# Altium project ApexVent1.PrjPcb
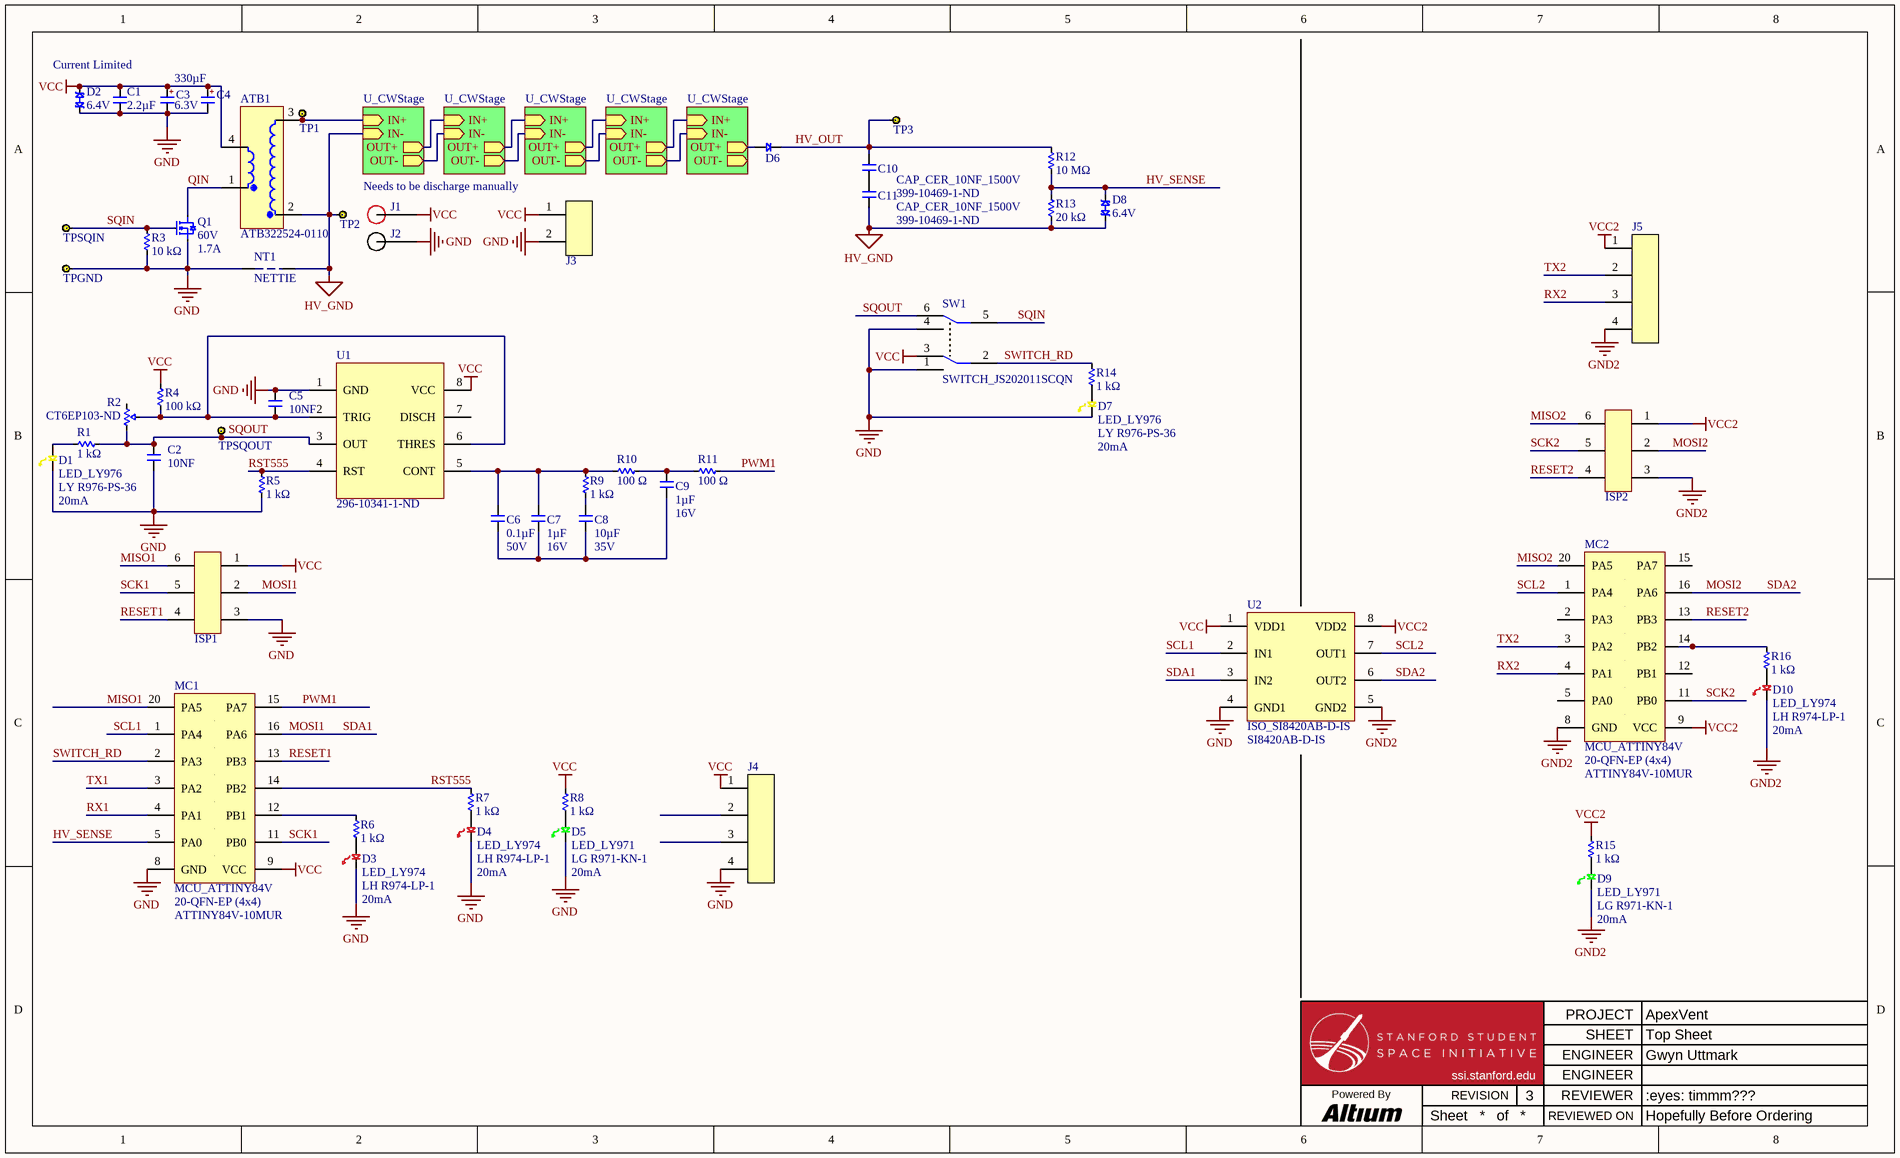
[diagram p0: TopSheet.SchDoc]
prjTitle: ApexVent; prjRevision: 3; prjReviewer: :eyes: timmm???; prjReviewDate: Hopefully Before Ordering; prjEngineer1: Gwyn Uttmark
2 sheets, 88 parts. Net scope: strictly hierarchical (ports join the sheet entries above them; power ports are local).
Board file: TopSheet.PcbDoc
Sheets:
  TopSheet.SchDoc
    U_CWStage = CWStage.SchDoc
    U_CWStage = CWStage.SchDoc
    U_CWStage = CWStage.SchDoc
    U_CWStage = CWStage.SchDoc
    U_CWStage = CWStage.SchDoc

## Sheet TopSheet.SchDoc: Top Sheet
size Legal; Project: World Domination Satellite

### Parts
ATB1  ATB322524-0110  [ATB3225]
C1  Capacitance (shorthand): 2.2µF  [C0603]  (hidden comment: __template_cap)
C2  10NF  [C1206]
C3  Capacitance: 330µF  Voltage - Rated: 6.3V  [C1210P]  (hidden comment: CAP_TANT_330UF_6.3V)
C4  CAP_TANT_330UF_6.3V  [C1210P]  (value not drawn)
C5  10NF  [C1206]
C6  Capacitance (shorthand): 0.1µF  Rated Voltage: 50V  [C0603]  (hidden comment: __template_cap)
C7  Capacitance (shorthand): 1µF  Rated Voltage: 16V  [C0603]  (hidden comment: __template_cap)
C8  Capacitance (shorthand): 10µF  Rated Voltage: 35V  [C0603]  (hidden comment: __template_cap)
C9  Capacitance (shorthand): 1µF  Rated Voltage: 16V  [C0603]  (hidden comment: __template_cap)
C10  CAP_CER_10NF_1500V  Supplier Part Number 1: 399-10469-1-ND  [C1206]
C11  CAP_CER_10NF_1500V  Supplier Part Number 1: 399-10469-1-ND  [C1206]
D1  LED_LY976  Manufacturer Part Number: LY R976-PS-36  Current - Test: 20mA  [0805_Diode]
D2  Voltage - Breakdown: 6.4V  [SMC]  (hidden comment: TVS_BI_SMDJ5.0CA)
D3  LED_LY974  Manufacturer Part Number: LH R974-LP-1  Current - Test: 20mA  [0805_Diode]
D4  LED_LY974  Manufacturer Part Number: LH R974-LP-1  Current - Test: 20mA  [0805_Diode]
D5  LED_LY971  Manufacturer Part Number: LG R971-KN-1  Current - Test: 20mA  [0805_Diode]
D6  DIODE_ S1PM-M3/84A  [DO-220AA]  (value not drawn)
D7  LED_LY976  Manufacturer Part Number: LY R976-PS-36  Current - Test: 20mA  [0805_Diode]
D8  Voltage - Breakdown: 6.4V  [SMC]  (hidden comment: TVS_BI_SMDJ5.0CA)
D9  LED_LY971  Manufacturer Part Number: LG R971-KN-1  Current - Test: 20mA  [0805_Diode]
D10  LED_LY974  Manufacturer Part Number: LH R974-LP-1  Current - Test: 20mA  [0805_Diode]
ISP1  CONN_2x3_15-91-2060  [MOLEX_15-91-2060]  (value not drawn)
ISP2  CONN_2x3_15-91-2060  [MOLEX_15-91-2060]  (value not drawn)
J1  J2  [CONN_BANANA_CALTEST_RED]  (value not drawn)
J2  CONN_BANNANAJACK_RA_BLACK_CT3151SP  [CONN_BANANA_CALTEST_BLACk]  (value not drawn)
J3  CONN HEADER 2POS VERT T/H  [CONN_1x2_100MIL]  (value not drawn)
J4  CONN_1x4  [CONN_1x4_100MIL]  (value not drawn)
J5  CONN_1x4  [CONN_1x4_100MIL]  (value not drawn)
MC1  MCU_ATTINY84V  Supplier Device Package: 20-QFN-EP (4x4)  Manufacturer Part Number: ATTINY84V-10MUR  [20QFN4]
MC2  MCU_ATTINY84V  Supplier Device Package: 20-QFN-EP (4x4)  Manufacturer Part Number: ATTINY84V-10MUR  [20QFN4]
NT1  NETTIE  [NETTIE_10MIL]  (net tie, no BOM)
Q1  Drain to Source Voltage (Vdss): 60V  Current - Continuous Drain (Id) @ 25° C: 1.7A  [3SOT23]  (hidden comment: MOSFET N-CH 60V 1.7A SSOT3)
R1  Resistance: 1 kΩ  [R0805]  (hidden comment: __template_resistor)
R2  Supplier Part Number 1: CT6EP103-ND  [CT6EP]  (hidden comment: POT_10K_CT6EP103)
R3  Resistance: 10 kΩ  [R0603]  (hidden comment: __template_resistor)
R4  Resistance: 100 kΩ  [R0805]  (hidden comment: __template_resistor)
R5  Resistance: 1 kΩ  [R0805]  (hidden comment: __template_resistor)
R6  Resistance: 1 kΩ  [R0805]  (hidden comment: __template_resistor)
R7  Resistance: 1 kΩ  [R0805]  (hidden comment: __template_resistor)
R8  Resistance: 1 kΩ  [R0805]  (hidden comment: __template_resistor)
R9  Resistance: 1 kΩ  [R0805]  (hidden comment: __template_resistor)
R10  Resistance: 100 Ω  [R0805]  (hidden comment: __template_resistor)
R11  Resistance: 100 Ω  [R0805]  (hidden comment: __template_resistor)
R12  Resistance: 10 MΩ  [R0805]  (hidden comment: __template_resistor)
R13  Resistance: 20 kΩ  [R0805]  (hidden comment: __template_resistor)
R14  Resistance: 1 kΩ  [R0805]  (hidden comment: __template_resistor)
R15  Resistance: 1 kΩ  [R0805]  (hidden comment: __template_resistor)
R16  Resistance: 1 kΩ  [R0805]  (hidden comment: __template_resistor)
SW1  SWITCH_JS202011SCQN  [SWITCH_DUAL_POS]
TP1  TEST_POINT_BLACK_KEYSTONE_5001  [TEST_POINT_KEYSTONE_5001]  (value not drawn)
TP2  TEST_POINT_BLACK_KEYSTONE_5001  [TEST_POINT_KEYSTONE_5001]  (value not drawn)
TP3  TEST_POINT_BLACK_KEYSTONE_5001  [TEST_POINT_KEYSTONE_5001]  (value not drawn)
TPGND  TEST_POINT_BLACK_KEYSTONE_5001  [TEST_POINT_KEYSTONE_5001]  (value not drawn)
TPSQIN  TEST_POINT_BLACK_KEYSTONE_5001  [TEST_POINT_KEYSTONE_5001]  (value not drawn)
TPSQOUT  TEST_POINT_BLACK_KEYSTONE_5001  [TEST_POINT_KEYSTONE_5001]  (value not drawn)
U1  Supplier Part Number 1: 296-10341-1-ND  [8SOIC150]  (hidden comment: TIM_TLC555)
U2  ISO_SI8420AB-D-IS  Manufacturer Part Number: SI8420AB-D-IS  [8SOIC150]

### Sub-sheets
U_CWStage = CWStage.SchDoc: IN- (in), IN+ (in), OUT+ (out), OUT- (out)
U_CWStage = CWStage.SchDoc: IN- (in), IN+ (in), OUT+ (out), OUT- (out)
U_CWStage = CWStage.SchDoc: IN- (in), IN+ (in), OUT+ (out), OUT- (out)
U_CWStage = CWStage.SchDoc: IN- (in), IN+ (in), OUT+ (out), OUT- (out)
U_CWStage = CWStage.SchDoc: IN- (in), IN+ (in), OUT+ (out), OUT- (out)

### Nets
GND: C1.2 C2.2 C3.2 C4.2 C5.1 D1.1 D2.1 D3.1 D4.1 D5.1 D7.1 ISP1.3 J2.SIG J3.2 J4.4 MC1.8(GND) NT1.1 Q1.2 R3.1 R5.1 SW1.1 SW1.4 TPGND.1 U1.1(GND) U2.4(GND1)
GND2: D9.1 D10.1 ISP2.3 J5.4 MC2.8(GND) U2.5(GND2)
HV_GND: ATB1.2 C11.1 D8.1 NT1.2 R13.2 TP2.1 ; sheet U_CWStage/IN-
VCC: ATB1.4 C1.1 C3.1 C4.1 D2.2 ISP1.1 J1.SIG J3.1 J4.1 MC1.9(VCC) R4.2 R8.2 SW1.3 U1.8(VCC) U2.1(VDD1)
VCC2: ISP2.1 J5.1 MC2.9(VCC) R15.2 U2.8(VDD2)
HV_OUT: C10.2 D6.1 R12.1 TP3.1
HV_SENSE: D8.2 MC1.5(PA0) R12.2 R13.1
MISO1: ISP1.6 MC1.20(PA5)
MISO2: ISP2.6 MC2.20(PA5)
MOSI1: ISP1.2 MC1.16(PA6) U2.3(IN2)  [also labelled SDA1]
MOSI2: ISP2.2 MC2.16(PA6) U2.6(OUT2)  [also labelled SDA2]
PWM1: MC1.15(PA7) R11.2
QIN: ATB1.1 Q1.3
RESET1: ISP1.4 MC1.13(PB3)
RESET2: ISP2.4 MC2.13(PB3)
RST555: MC1.14(PB2) R5.2 R7.2 U1.4(RST)
RX1: MC1.4(PA1)
RX2: J5.3 MC2.4(PA1)
SCK1: ISP1.5 MC1.11(PB0)
SCK2: ISP2.5 MC2.11(PB0)
SCL1: MC1.1(PA4) U2.2(IN1)
SCL2: MC2.1(PA4) U2.7(OUT1)
SQIN: Q1.1 R3.2 SW1.5 TPSQIN.1
SQOUT: C2.1 R1.1 R2.1 SW1.6 TPSQOUT.1 U1.3(OUT)
SWITCH_RD: MC1.2(PA3) R14.2 SW1.2
TX1: MC1.3(PA2)
TX2: J5.2 MC2.3(PA2)
NetATB1_3: ATB1.3 TP1.1 ; sheet U_CWStage/IN+
NetC5_2: C5.2 R2.2 R4.1 U1.2(TRIG) U1.6(THRES)
NetC6_1: C6.1 C7.1 R9.2 R10.1 U1.5(CONT)
NetC6_2: C6.2 C7.2 C8.2 C9.2
NetC8_1: C8.1 R9.1
NetC9_1: C9.1 R10.2 R11.1
NetC10_1: C10.1 C11.2
NetC12A_2: sheet U_CWStage/OUT+, sheet U_CWStage/IN+
NetC12B_2: sheet U_CWStage/OUT+, sheet U_CWStage/IN+
NetC12C_2: sheet U_CWStage/OUT+, sheet U_CWStage/IN+
NetC12D_2: sheet U_CWStage/OUT+, sheet U_CWStage/IN+
NetC12E_2: D6.2 ; sheet U_CWStage/OUT+
NetC13A_2: sheet U_CWStage/OUT-, sheet U_CWStage/IN-
NetC13B_2: sheet U_CWStage/OUT-, sheet U_CWStage/IN-
NetC13C_2: sheet U_CWStage/OUT-, sheet U_CWStage/IN-
NetC13D_2: sheet U_CWStage/OUT-, sheet U_CWStage/IN-
NetD1_2: D1.2 R1.2
NetD3_2: D3.2 R6.1
NetD4_2: D4.2 R7.1
NetD5_2: D5.2 R8.1
NetD7_2: D7.2 R14.1
NetD9_2: D9.2 R15.1
NetD10_2: D10.2 R16.1
NetMC1_12: MC1.12(PB1) R6.2
NetMC2_14: MC2.14(PB2) R16.2

Not connected (* = marked no-connect by the designer): J4 2 3; MC1 6(DNC) 7(DNC) 10(DNC) 17(DNC) 18(DNC) 19(DNC); MC2 2(PA3) 5(PA0) 6(DNC) 7(DNC) 10(DNC) 12(PB1) 15(PA7) 17(DNC) 18(DNC) 19(DNC); R2 3; U1 7(DISCH)

### Notes on the sheet
- Current Limited
- Needs to be discharge manually
- PROJECT
- SHEET
- Powered By
- Sheet
- of
- REVISION
- ssi.stanford.edu
- ENGINEER
- REVIEWER
- REVIEWED ON
- (in symbol CAP_TANT_330UF_6.3V) +

### Library data of the parts
ATB1 = CMP-053-0002-3: DC Resistance (DCR): 60R; Inductance: 7uH; Isolation Voltage: 500V; Lead/Base Style: Solder; Max DC Current: 700mA; Turns Ratio: 1:10; Height: 2.4mm; Width: 2.5mm; Packaging: Tape and Reel; Package Quantity: 1; Mount: Surface Mount; Lead Free: Lead Free; Depth: 2.4mm; Length: 3.2mm; Termination: SMD/SMT; Max Operating Temperature: 85°C; Height - Seated (Max): 2.4mm; Min Operating Temperature: -40°C
C1 = 490-10731-1-ND: CAP CER 2.2UF 16V X5R 0603 10%; Rated Voltage: 25V; Supplier Part Number 1: 490-10731-1-ND
C2 C5 = CAP_CER_10NF_1500V: Supplier 1: Digi-Key; Supplier Part Number 1: 399-10469-1-ND
C3 = CAP_TANT_330UF_6.3V: 330UF 1210 SMD TANTALUM CAPACITOR; Manufacturer: AVX Corporation; Manufacturer Part Number: F950J337KBAAQ2; Manufacturer Size Code: B; Tolerance: ±10%; ESR (Equivalent Series Resistance): 600 mOhm; Type: Conformal Coated; Supplier 1: Digi-Key; RoHS: RoHS Compliant; Category: Capacitors; Stock 1: 12610; Pricing 1: 1=2.24, 10=1.857, 100=1.5567, 250=1.28356, 500=1.14702, 1000=1.03778 (USD); Packaging: Cut Tape (CT); Operating Temperature: -55°C ~ 125°C; Mounting Type: Surface Mount; Package / Case: 1210 (3528 Metric); Size / Dimension: 0.138" L x 0.110" W (3.50mm x 2.80mm); Height - Seated (Max): 0.079" (2.00mm); Lead Spacing: -; Features: General Purpose; Lifetime @ Temp.: -; ComponentLink1URL: http://datasheets.avx.com/f95.pdf; ComponentLink1Description: http://datasheets.avx.com/f95.pdf; Supplier Part Number 1: 478-8407-1-ND
C4 = CAP_TANT_330UF_6.3V: 330UF 1210 SMD TANTALUM CAPACITOR; Manufacturer: AVX Corporation; Manufacturer Part Number: F950J337KBAAQ2; Manufacturer Size Code: B; Tolerance: ±10%; ESR (Equivalent Series Resistance): 600 mOhm; Type: Conformal Coated; Capacitance: 330µF; Voltage - Rated: 6.3V; Supplier 1: Digi-Key; RoHS: RoHS Compliant; Category: Capacitors; Stock 1: 12610; Pricing 1: 1=2.24, 10=1.857, 100=1.5567, 250=1.28356, 500=1.14702, 1000=1.03778 (USD); Packaging: Cut Tape (CT); Operating Temperature: -55°C ~ 125°C; Mounting Type: Surface Mount; Package / Case: 1210 (3528 Metric); Size / Dimension: 0.138" L x 0.110" W (3.50mm x 2.80mm); Height - Seated (Max): 0.079" (2.00mm); Lead Spacing: -; Features: General Purpose; Lifetime @ Temp.: -; ComponentLink1URL: http://datasheets.avx.com/f95.pdf; ComponentLink1Description: http://datasheets.avx.com/f95.pdf; Supplier Part Number 1: 478-8407-1-ND
C6 = 490-1519-1-ND: CAP CER 0603 0.1µF X7R 50V 10%; Manufacturer: Murata Electronics North America; Capacitance - pF (Machine readable): #NAME?; type: capacitor; Supplier Part Number 1: 490-1519-1-ND; Dielectric: X7R; Supplier 1: Digikey
C7 C9 = 490-3900-1-ND: CAP CER 0603 1µF X7R 16V 10%; Manufacturer: Murata Electronics North America; Capacitance - pF (Machine readable): #NAME?; type: capacitor; Supplier Part Number 1: 490-3900-1-ND; Dielectric: X7R; Supplier 1: Digikey
C8 = 490-13248-1-ND: CAP CER 10UF 35V X5R 0603 20%; Manufacturer: Murata Electronics North America; Capacitance - pF (Machine readable): #NAME?; type: capacitor; Supplier Part Number 1: 490-13248-1-ND; Dielectric: X5R; Supplier 1: Digikey
D1 D7 = CMP-033-0002-1: LED 0805 YELLOW 20MA; Manufacturer: OSRAM Opto Semiconductors Inc; Lens Color: White; Lens Transparency: Diffused; Lens Style/Size: Rectangle with Flat Top, 1.30mm x 1.25mm; Voltage - Forward (Vf) (Typ): 2V; Wavelength - Peak: 591nm; Millicandela Rating: 162.5mcd; Wavelength - Dominant: 588nm; Viewing Angle: 160°; Height (Max): 0.80mm; ComponentLink1Description: http://www.osram-os.com/Graphics/XPic9/00078941_0.pdf; Stock 1: 22712; ComponentLink1URL: http://www.osram-os.com/Graphics/XPic9/00078941_0.pdf; Supplier Device Package: *; Mounting Type: Surface Mount; Size / Dimension: 2.00mm L x 1.25mm W; Source: diode.SchLib; Packaging: Cut Tape (CT); Package / Case: 0805 (2012 Metric); RoHS: RoHS Compliant; Design Item ID: LED_LY976; Color: Yellow; Pricing 1: 1=0.09, 10=0.072, 100=0.0576, 250=0.0504, 500=0.04608 (USD)
D2 D8 = TVS_BI_SMDJ5.0CA: DIODE TVS 5.0V 3000W 5% BI SMD; Manufacturer: Littelfuse Inc; Polarization: Bidirectional; Voltage - Reverse Standoff (Typ): 5V; Supplier 1: Digi-Key; Manufacturer Part Number: SMDJ5.0CA; RoHS: RoHS Compliant; Category: Circuit Protection; Stock 1: 9581; Pricing 1: 1=1.14, 10=1.023, 25=0.9032, 100=0.8127, 250=0.70736, 500=0.6321, 1000=0.49665 (USD); Mounting Type: Surface Mount; Package / Case: DO-214AB, SMC; Supplier Device Package: SMC; Packaging: Cut Tape (CT); ComponentLink1URL: http://www.littelfuse.com/data/en/Data_Sheets/Littelfuse_TVS-Diodes_SMDJ.pdf; ComponentLink1Description: Datasheet; Supplier Part Number 1: SMDJ5.0CACT-ND; Power (Watts): 3000W
D3 D4 D10 = CMP-033-0001-1: LED 0805 RED 20MA; Manufacturer: OSRAM Opto Semiconductors Inc; Millicandela Rating: 41mcd; Lens Style/Size: Rectangle with Flat Top, 1.30mm x 1.25mm; Wavelength - Peak: 660nm; Lens Transparency: Diffused; Wavelength - Dominant: 645nm; Viewing Angle: 160°; Voltage - Forward (Vf) (Typ): 1.8V; Lens Color: White; Mounting Type: Surface Mount; ComponentLink1Description: http://www.osram-os.com/Graphics/XPic8/00078869_0.pdf; Pricing 1: 1=0.08, 10=0.07, 100=0.0559, 250=0.04892, 500=0.04472 (USD); Packaging: Cut Tape (CT); Size / Dimension: 2.00mm L x 1.25mm W; Design Item ID: LED_LY974; Stock 1: 66379; Package / Case: 0805 (2012 Metric); ComponentLink1URL: http://www.osram-os.com/Graphics/XPic8/00078869_0.pdf; RoHS: RoHS Compliant; Color: Red; Supplier Device Package: *; Height (Max): 0.80mm; Source: diode.SchLib
D5 D9 = CMP-033-0000-1: LED 0805 GREEN 20MA; Manufacturer: OSRAM Opto Semiconductors Inc; Lens Color: White; Wavelength - Peak: 572nm; Lens Style/Size: Rectangle with Flat Top, 1.30mm x 1.25mm; Voltage - Forward (Vf) (Typ): 2.2V; Lens Transparency: Diffused; Wavelength - Dominant: 570nm; Millicandela Rating: 26.05mcd; Viewing Angle: 160°; Source: diode.SchLib; RoHS: RoHS Compliant; ComponentLink1URL: http://www.osram-os.com/Graphics/XPic9/00078860_0.pdf; Mounting Type: Surface Mount; ComponentLink1Description: http://www.osram-os.com/Graphics/XPic9/00078860_0.pdf; Packaging: Cut Tape (CT); Supplier Device Package: *; Package / Case: 0805 (2012 Metric); Design Item ID: LED_LY971; Size / Dimension: 2.00mm L x 1.25mm W; Pricing 1: 1=0.08, 10=0.069, 100=0.0548, 250=0.04796, 500=0.04384 (USD); Stock 1: 89733; Height (Max): 0.80mm; Color: Green
ISP1 ISP2 = CMP-029-0049-1: CONN HEADER 6POS .100" VERT TIN; Manufacturer: Molex Inc; Manufacturer Part Number: 0015912060; Pitch: 0.100" (2.54mm); Number of Positions Loaded: All; Connector Type: Header, Unshrouded, Breakaway; Number of Positions: 6; Contact Finish Thickness: 150µin (3.81µm); Number of Rows: 2; ComponentLink1Description: http://www.molex.com/pdm_docs/sd/015912060_sd.pdf; Mounting Type: Surface Mount; Contact Mating Length: 0.240" (6.10mm); Stock 1: 5665; Design Item ID: CONN_2x3_15-91-2060; ComponentLink1URL: http://www.molex.com/pdm_docs/sd/015912060_sd.pdf; Pricing 1: 1=0.43, 10=0.4, 50=0.32, 100=0.3066, 250=0.27992, 500=0.2666, 1000=0.21995, 2500=0.19995, 5000=0.19329 (USD); Packaging: Bulk; Features: -; Source: connector.SchLib; Contact Finish: Tin; Fastening Type: -; Contact Type: Male Pin; Row Spacing: 0.100" (2.54mm); Termination: Solder; Color: Black; RoHS: RoHS Compliant
J1 = CONN_BANNANAJACK_RA_RED_CT3151SP: Manufacturer: B&K Precision; Manufacturer Part Number: CT3151-2; Body Material: Nylon,Polyamide; Gender: Female; Insulation: Mating End Insulated; Supplier 1: Digi-Key; Stock 1: 317; Pricing 1: 1=2.05 (USD); Colour: Red; Contact Material: Brass; Contact Plating: Nickel; Min Operating Temperature: -20°C; Max Operating Temperature: 80°C; Termination: Solder; Supplier Part Number 1: BKCT3151-2-ND
J2 = CONN_BANNANAJACK_RA_BLACK_CT3151SP: Manufacturer: B&K Precision; Manufacturer Part Number: CT3151-0; Body Material: Nylon,Polyamide; Gender: Female; Insulation: Mating End Insulated; Supplier 1: Digi-Key; Stock 1: 0; Pricing 1: 1=2.05 (USD); Colour: Black; Contact Material: Brass; Contact Plating: Nickel; Min Operating Temperature: -20°C; Max Operating Temperature: 80°C; Termination: Solder; Supplier Part Number 1: BKCT3151-0-ND
J3 = CONN_1x2: Manufacturer: FCI; Manufacturer Part Number: 77311-118-02LF; Connector Type: Header, Unshrouded; Number of Positions: 2; Number of Positions Loaded: All; Pitch: 0.100" (2.54mm); RoHS: RoHS Compliant; Category: Connectors, Interconnects; Contact Type: Male Pin; Number of Rows: 1; Row Spacing: -; Contact Mating Length: 0.230" (5.84mm); Mounting Type: Through Hole; Termination: Solder; Fastening Type: -; Features: -; Contact Finish: Gold, GXT™; Contact Finish Thickness: 30µin (0.76µm); Color: Black; Packaging: Bulk; ComponentLink1URL: http://portal.fciconnect.com/res/en/pdffiles/doc_search//77311.pdf; ComponentLink1Description: http://portal.fciconnect.com/res/en/pdffiles/doc_search//77311.pdf
J4 J5 = CMP-029-0003-1: CONN HEADER 4POS T/H; Design Item ID: CONN_1x4; Source: connector.SchLib
MC1 MC2 = CMP-049-0007-2: Attiny84 Surface Mount Extended Voltage Range; Manufacturer: Microchip Technology; Oscillator Type: Internal; EEPROM Size: 512 x 8; Core Size: 8-Bit; Connectivity: USI; Core Processor: AVR; Peripherals: Brown-out Detect/Reset, POR, PWM, Temp Sensor, WDT; Program Memory Size: 8KB (4K x 16); Data Converters: A/D 8x10b; Program Memory Type: FLASH; Speed: 10MHz; Voltage - Supply (Vcc/Vdd): 1.8 V ~ 5.5 V; Design Item ID: MCU_ATTINY84V; RoHS: RoHS Compliant; RAM Size: 512 x 8; Packaging: Cut Tape (CT); Part Status: Active; Package / Case: 20-WFQFN Exposed Pad; Operating Temperature: -40°C ~ 85°C (TA); Source: ic_processor.SchLib; Stock 1: 9687; Pricing 1: 1=1.01, 25=0.92, 100=0.835 (USD)
NT1 = CMP-057-0001-1: Net tie. Use sparingly.; Source: miscellaneous.SchLib; Design Item ID: NETTIE
Q1 = NFET_FDN5630: Manufacturer: Fairchild Semiconductor; FET Type: MOSFET N-Channel, Metal Oxide; FET Feature: Logic Level Gate; Rds On (Max) @ Id, Vgs: 100 mOhm @ 1.7A, 10V; Vgs(th) (Max) @ Id: 3V @ 250µA; Gate Charge (Qg) @ Vgs: 10nC @ 10V; Input Capacitance (Ciss) @ Vds: 400pF @ 15V; Power - Max: 460mW; Supplier 1: Digi-Key; Manufacturer Part Number: FDN5630; RoHS: RoHS Compliant; Category: Discrete Semiconductor Products; Stock 1: 136076; Pricing 1: 1=0.66, 10=0.532, 100=0.3986, 250=0.34428, 500=0.29596, 1000=0.22952 (USD); Mounting Type: Surface Mount; Package / Case: TO-236-3, SC-59, SOT-23-3; Supplier Device Package: 3-SSOT; Packaging: Cut Tape (CT); ComponentLink1URL: http://www.fairchildsemi.com/ds/FD/FDN5630.pdf; ComponentLink1Description: http://www.fairchildsemi.com/ds/FD/FDN5630.pdf; Supplier Part Number 1: FDN5630CT-ND
R1 R5-R9 R14-R16 = 311-1.00KCRCT-ND: RES SMD 1K OHM 1% 1/8W 0805; Manufacturer Part Number: RC0805FR-071KL; Manufacturer: Yageo; Resistance (Sortable): 1000; Power (Watts): 0.125W, 1/8W; Temperature Coefficient: ±100ppm/°C; Supplier Part Number 1: 311-1.00KCRCT-ND; Supplier 1: Digikey; Datasheets: http://www.yageo.com/documents/recent/PYu-RC_Group_51_RoHS_L_9.pdf; Image: //media.digikey.com/Renders/Yageo%20Renders/0805-(2012-Metric).jpg; Tolerance: ±1%; Operating Temperature: -55°C ~ 155°C
R2 = POT_10K_CT6EP103: Manufacturer: Copal Electronics Inc; Resistance (Ohms): 10k; Power (Watts): 0.5W, 1/2W; Tolerance: ±10%; Temperature Coefficient: ±100ppm/°C; Number of Turns: Single; Adjustment Type: Top Adjustment; Resistive Material: Cermet; Supplier 1: Digi-Key; Manufacturer Part Number: CT6EP103; RoHS: RoHS Compliant; Category: Potentiometers, Variable Resistors; Stock 1: 23818; Pricing 1: 1=0.79, 10=0.711, 25=0.6428, 50=0.6196, 100=0.5852, 250=0.56228, 500=0.52786, 1000=0.43605, 2500=0.39015 (USD); Packaging: Bulk; Mounting Type: Through Hole; Termination Style: PC Pin; Size / Dimension: Square - 0.276" x 0.276" Face x 0.228" L (7.00mm x 7.00mm x 5.80mm); ComponentLink1URL: http://www.nidec-copal-electronics.com/e/catalog/trimmer/ct-6.pdf; ComponentLink1Description: http://www.nidec-copal-electronics.com/e/catalog/trimmer/ct-6.pdf
R3 = RES SMD 10K OHM 1% 1/10W 0603: Manufacturer Part Number: RC0603FR-0710KL; Manufacturer: Yageo; Resistance (Sortable): 10000; Power (Watts): 0.1W, 1/10W; Temperature Coefficient: ±100ppm/°C; Supplier 1: Digikey; Datasheets: http://www.yageo.com/documents/recent/PYu-RC_Group_51_RoHS_L_9.pdf; Image: //media.digikey.com/Renders/Yageo%20Renders/0603-(1608-Metric).jpg; Supplier Part Number 1: 311-10.0KHRCT-ND; Tolerance: ±1%; Operating Temperature: -55°C ~ 155°C
R4 = 311-100KCRCT-ND: RES SMD 100K OHM 1% 1/8W 0805; Supplier Part Number 1: 311-100KCRCT-ND
R10 R11 = 311-100CRCT-ND: RES SMD 100 OHM 1% 1/8W 0805; Manufacturer Part Number: RC0805FR-07100RL; Manufacturer: Yageo; Resistance (Sortable): 100; Power (Watts): 0.125W, 1/8W; Temperature Coefficient: ±100ppm/°C; Supplier Part Number 1: 311-100CRCT-ND; Supplier 1: Digikey; Datasheets: http://www.yageo.com/documents/recent/PYu-RC_Group_51_RoHS_L_9.pdf; Image: //media.digikey.com/Renders/Yageo%20Renders/0805-(2012-Metric).jpg; Tolerance: ±1%; Operating Temperature: -55°C ~ 155°C
R12 = 311-10.0MCRCT-ND: RES SMD 10M OHM 1% 1/8W 0805; Manufacturer Part Number: RC0805FR-0710ML; Manufacturer: Yageo; Resistance (Sortable): 10000000; Power (Watts): 0.125W, 1/8W; Temperature Coefficient: ±100ppm/°C; Supplier Part Number 1: 311-10.0MCRCT-ND; Supplier 1: Digikey; Datasheets: http://www.yageo.com/documents/recent/PYu-RC_Group_51_RoHS_L_9.pdf; Image: //media.digikey.com/Renders/Yageo%20Renders/0805-(2012-Metric).jpg; Tolerance: ±1%; Operating Temperature: -55°C ~ 155°C
R13 = 311-20.0KCRCT-ND: RES SMD 20K OHM 1% 1/8W 0805; Manufacturer Part Number: RC0805FR-0720KL; Manufacturer: Yageo; Resistance (Sortable): 20000; Power (Watts): 0.125W, 1/8W; Temperature Coefficient: ±100ppm/°C; Supplier Part Number 1: 311-20.0KCRCT-ND; Supplier 1: Digikey; Datasheets: http://www.yageo.com/documents/recent/PYu-RC_Group_51_RoHS_L_9.pdf; Image: //media.digikey.com/Renders/Yageo%20Renders/0805-(2012-Metric).jpg; Tolerance: ±1%; Operating Temperature: -55°C ~ 155°C
SW1 = CMP-062-0014-1: SWITCH SLIDE DPDT 0.3A 6V SMT; Manufacturer: C&K Components; Contact Timing: Not Specified; Actuator Material: Polyamide (PA46), Nylon 4/6; Actuator Type: Standard; Electrical Life: 5,000 Cycles; Current Rating: 300mA (DC); Switch Function: On-On; Switch Travel: 2.00mm; Contact Material: Copper Alloy; Contact Finish: Silver; Termination Style: Gull Wing; Operating Temperature: -40°C ~ 85°C; RoHS: RoHS Compliant; Manufacturer Part Number: JS202011SCQN; Mounting Type: Surface Mount; Source: miscellaneous.SchLib; ComponentLink1URL: http://www.ck-components.com/media/1422/js.pdf; Part Status: Active; Voltage Rating - DC: 6V; Stock 1: 64223; ComponentLink1Description: http://www.ck-components.com/media/1422/js.pdf; Features: -; Operating Force: -; Circuit: DPDT; Voltage Rating - AC: -; Design Item ID: SWITCH_JS202011SCQN; Mechanical Life: -; Pricing 1: 1=0.46, 10=0.441, 25=0.4316, 50=0.3858, 100=0.3674, 250=0.3582, 500=0.3031 (USD); Actuator Length: 2.00mm; Packaging: Cut Tape (CT)
TP1-TP3 TPGND TPSQIN TPSQOUT = TEST_POINT_BLACK_KEYSTONE_5001: BLACK T/H TEST POINT; Manufacturer: Keystone Electronics; Manufacturer Part Number: 5001; Plating: Silver; Material - Insulation: Nylon 46, UL 94V-0; Material - Body: Phosphor Bronze; Supplier 1: Digi-Key; RoHS: RoHS Compliant; Category: Test and Measurement; Stock 1: 718799; Pricing 1: 1=0.37, 10=0.316, 50=0.2298, 100=0.2209, 250=0.19832, 500=0.18932, 1000=0.1616, 2500=0.14424, 5000=0.13523 (USD); Packaging: Bulk; Part Status: Active; Type: PC Test Point, Miniature; Mounting Type: 0.040" (1.02mm) Hole Diameter; Color: Black; Size / Dimension: 0.100" Dia x 0.180" L (2.54mm x 4.57mm); ComponentLink1URL: http://www.keyelco.com/product-pdf.cfm?p=1310; ComponentLink1Description: http://www.keyelco.com/product-pdf.cfm?p=1310; Supplier Part Number 1: 36-5001-ND
U1 = TIM_TLC555: IC OSC SGL TIMER 2.1MHZ; Manufacturer: Texas Instruments; Manufacturer Part Number: TLC555QDR; Voltage - Supply: 5 V ~ 15 V; Current - Supply: 360µA; Supplier 1: Digi-Key; RoHS: RoHS Compliant; Category: Integrated Circuits (ICs); Stock 1: 16547; Pricing 1: 1=0.88, 10=0.769, 25=0.6796, 100=0.5921, 250=0.51548, 500=0.43878, 750=0.3834, 1000=0.35145 (USD); Packaging: Cut Tape (CT); Type: 555 Type, Timer/Oscillator (Single); Count: -; Frequency: 2.1MHz; Operating Temperature: -40°C ~ 125°C; Package / Case: 8-SOIC (0.154", 3.90mm Width); Supplier Device Package: 8-SOIC; Mounting Type: Surface Mount; ComponentLink1URL: http://www.ti.com/lit/ds/symlink/tlc555.pdf; ComponentLink1Description: http://www.ti.com/lit/ds/symlink/tlc555.pdf
U2 = CMP-046-0003-1: IC ISOLATOR 2CH 5.5V 8-SOIC; Manufacturer: Silicon Laboratories  Inc; Voltage - Isolation: 2500Vrms; Propagation Delay: 35ns; Number of Channels: 2; Data Rate: 1Mbps; Voltage - Supply: 2.7 V ~ 5.5 V; Output Type: Logic; Inputs - Side 1/Side 2: 2/0; Stock 1: 0; ComponentLink1URL: https://www.silabs.com/Support%20Documents/TechnicalDocs/Si8410.pdf; Operating Temperature: -40°C ~ 125°C; Package / Case: 8-SOIC (0.154", 3.90mm Width); RoHS: RoHS Compliant; Packaging: Tube; ComponentLink1Description: Datasheet; Pricing 1: 1=1.08, 25=1.0444, 100=1.0044, 1000=0.8748 (USD); Supplier Device Package: 8-SOICN; Design Item ID: ISO_SI8420AB-D-IS; Source: ic_interface.SchLib
C10 C11 = CAP_CER_10NF_1500V: Supplier 1: Digi-Key
D6 = DIODE_ S1PM-M3/84A: Supplier 1: Digi-Key; Supplier Part Number 1: S1PM-M3/84AGICT-ND

## Sheet CWStage.SchDoc
size A
Used 5 times, as channels U_CWStage, U_CWStage, U_CWStage, U_CWStage, U_CWStage. Parts and nets are listed once, with the designators drawn on the sheet.
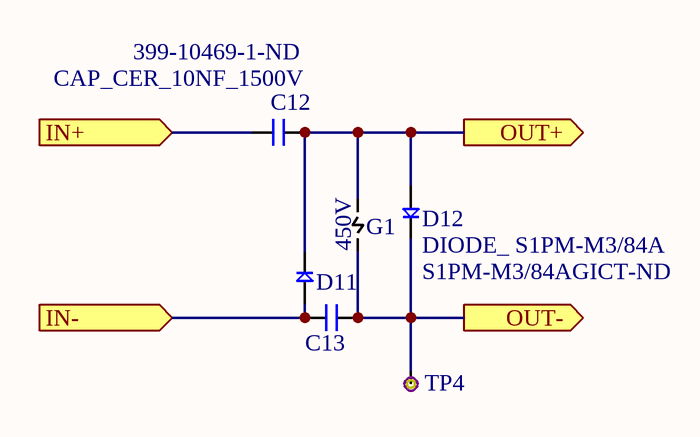
[diagram p1: CWStage.SchDoc]

### Parts
C12  CAP_CER_10NF_1500V  Supplier Part Number 1: 399-10469-1-ND  [C1206]
C13  CAP_CER_10NF_1500V  [C1206]  (value not drawn)
D11  DIODE_ S1PM-M3/84A  [DO-220AA]  (value not drawn)
D12  DIODE_ S1PM-M3/84A  Supplier Part Number 1: S1PM-M3/84AGICT-ND  [DO-220AA]
G1  450V  [SPARK_GAP_450V]
TP4  TEST_POINT_PURPLE_KEYSTONE_5119  [TEST_POINT_KEYSTONE_5119]  (value not drawn)

### Ports
IN+ (in), IN- (in), OUT+ (out), OUT- (out)

### Nets
IN+: C12.1 ; port IN+
IN-: C13.1 D11.2 ; port IN-
OUT+: C12.2 D11.1 D12.2 G1.2 ; port OUT+
OUT-: C13.2 D12.1 G1.1 TP4.1 ; port OUT-

### Channels
U_CWStage: designators end in A; ports IN+=NetATB1_3 IN-=HV_GND OUT+=NetC12A_2 OUT-=NetC13A_2
U_CWStage: designators end in B; ports IN+=NetC12A_2 IN-=NetC13A_2 OUT+=NetC12B_2 OUT-=NetC13B_2
U_CWStage: designators end in C; ports IN+=NetC12B_2 IN-=NetC13B_2 OUT+=NetC12C_2 OUT-=NetC13C_2
U_CWStage: designators end in D; ports IN+=NetC12C_2 IN-=NetC13C_2 OUT+=NetC12D_2 OUT-=NetC13D_2
U_CWStage: designators end in E; ports IN+=NetC12D_2 IN-=NetC13D_2 OUT+=NetC12E_2 OUT-=NetC13E_2

### Library data of the parts
G1 = SPARK_GAP_450V
TP4 = TEST_POINT_PURPLE_KEYSTONE_5119: PURPLE T/H TEST POINT; Manufacturer: Keystone Electronics; Manufacturer Part Number: 5119; Plating: Silver; Material - Insulation: Nylon 46, UL 94V-0; Material - Body: Phosphor Bronze; Supplier 1: Digi-Key; RoHS: RoHS Compliant; Category: Test and Measurement; Stock 1: 19346; Pricing 1: 1=0.37, 10=0.316, 50=0.2298, 100=0.2209, 250=0.19832, 500=0.18932, 1000=0.1616, 2500=0.14424, 5000=0.13523 (USD); Packaging: Bulk; Part Status: Active; Type: PC Test Point, Miniature; Mounting Type: 0.040" (1.02mm) Hole Diameter; Color: Purple; Size / Dimension: 0.100" Dia x 0.180" L (2.54mm x 4.57mm); ComponentLink1URL: http://www.keyelco.com/product-pdf.cfm?p=1338; ComponentLink1Description: http://www.keyelco.com/product-pdf.cfm?p=1338; Supplier Part Number 1: 36-5119-ND
C12 C13 = CAP_CER_10NF_1500V: Supplier 1: Digi-Key
  C13: Supplier Part Number 1: 399-10469-1-ND
D11 D12 = DIODE_ S1PM-M3/84A: Supplier 1: Digi-Key
  D11: Supplier Part Number 1: S1PM-M3/84AGICT-ND

## Nets that join several sheets
HV_GND: TopSheet (6 pins), U_CWStage (C13A.1 D11A.2)
NetATB1_3: TopSheet (ATB1.3 TP1.1), U_CWStage (C12A.1)
NetC12A_2: U_CWStage (C12A.2 D11A.1 D12A.2 G1A.2), U_CWStage (C12B.1)
NetC12B_2: U_CWStage (C12B.2 D11B.1 D12B.2 G1B.2), U_CWStage (C12C.1)
NetC12C_2: U_CWStage (C12C.2 D11C.1 D12C.2 G1C.2), U_CWStage (C12D.1)
NetC12D_2: U_CWStage (C12D.2 D11D.1 D12D.2 G1D.2), U_CWStage (C12E.1)
NetC12E_2: TopSheet (D6.2), U_CWStage (C12E.2 D11E.1 D12E.2 G1E.2)
NetC13A_2: U_CWStage (C13A.2 D12A.1 G1A.1 TP4A.1), U_CWStage (C13B.1 D11B.2)
NetC13B_2: U_CWStage (C13B.2 D12B.1 G1B.1 TP4B.1), U_CWStage (C13C.1 D11C.2)
NetC13C_2: U_CWStage (C13C.2 D12C.1 G1C.1 TP4C.1), U_CWStage (C13D.1 D11D.2)
NetC13D_2: U_CWStage (C13D.2 D12D.1 G1D.1 TP4D.1), U_CWStage (C13E.1 D11E.2)